# EAGLE design Si1145 (EAGLE 7.4.0)
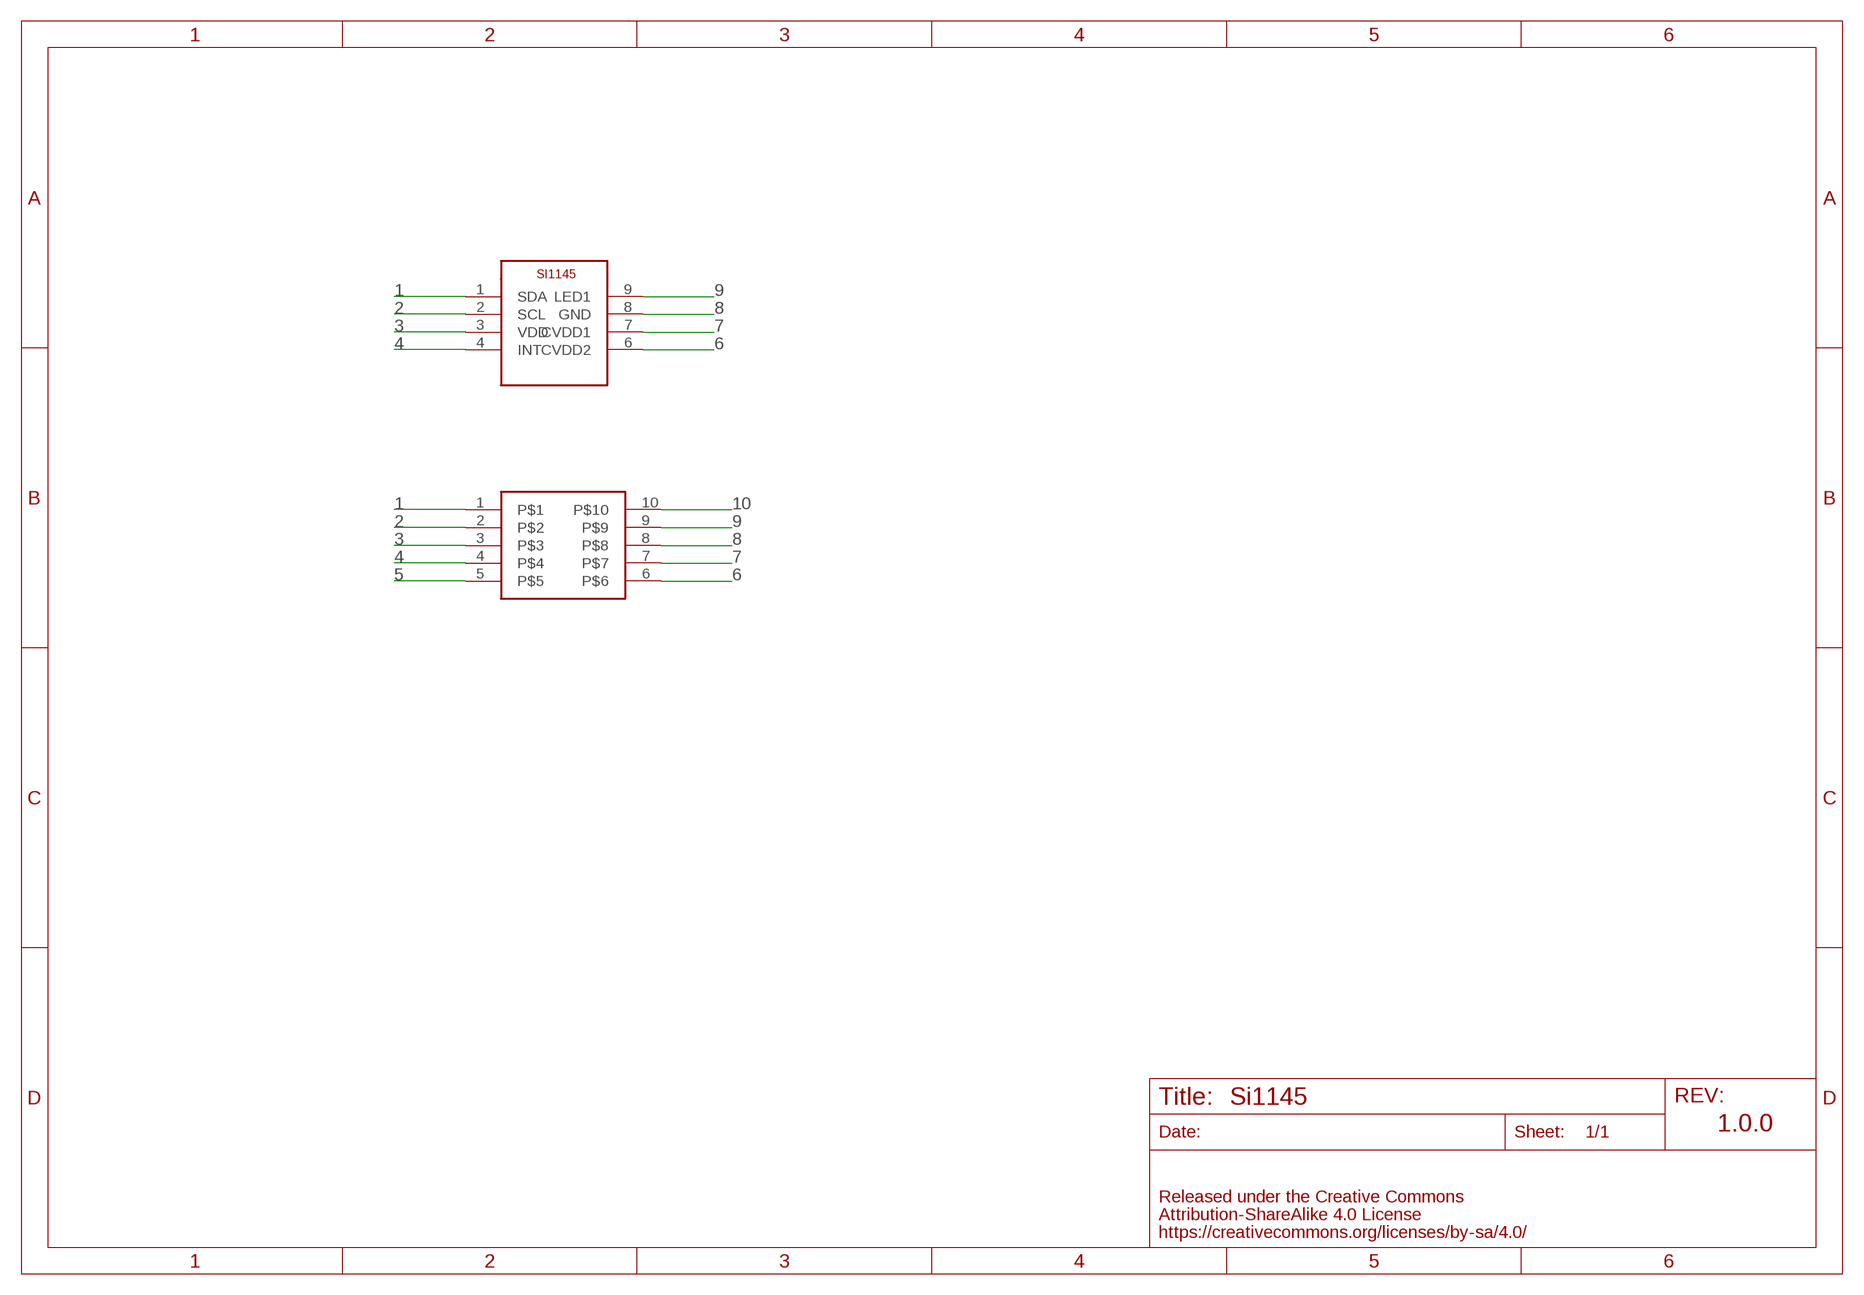
[diagram p0: schematic, sheet 1]

## Parts
SI1145  SL-SI1145  [SILICONLABS-SI1145]
U$2  10PIN  [10PIN]

## Nets
1: SI1145.1(SDA) U$2.1
2: SI1145.2(SCL) U$2.2
3: SI1145.3(VDD) U$2.3
4: SI1145.4(INT) U$2.4
5: U$2.5
6: SI1145.6(CVDD2) U$2.6
7: SI1145.7(CVDD1) U$2.7
8: SI1145.8(GND) U$2.8
9: SI1145.9(LED1) U$2.9
10: U$2.10

## Notes on the sheet
- 1.0.0

## Library data of the parts
SI1145 = FaBo-Mems:SL-SI1145: SILICONLABS SI1145(PROXIMITY/UV/AMBIENT LIGHT SENSOR)
U$2 = FaBo-Breakout:10PIN

## Board
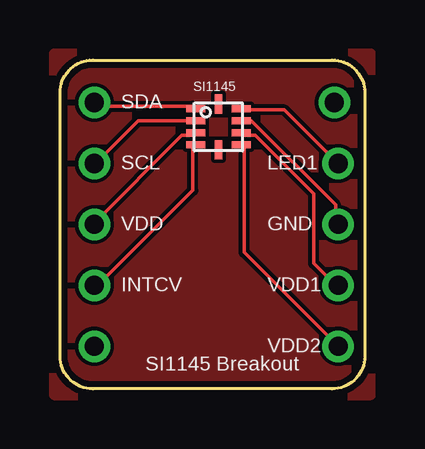
[diagram p1: board, top side]
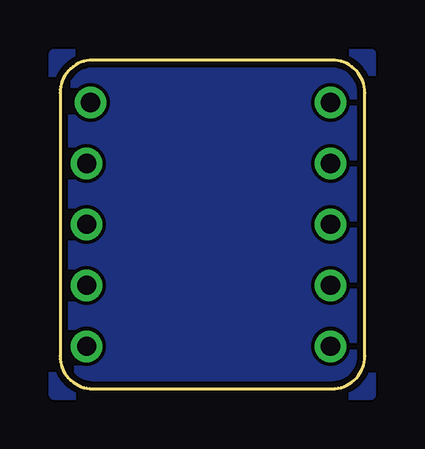
[diagram p2: board, bottom side, seen from below]

Size 12.7 x 13.7 mm. Coordinates in mm from the lower left corner, seen from the top.
Copper layers (1*16): Top 0.035mm / dielectric 1.5mm / Bottom 0.035mm
Design rules "Elecrow_2-layer_eagle_rule": minimum track width 6mil, minimum drill 12mil, track to track 6mil, track to pad 6mil, pad to pad 6mil, via to via 6mil, smd to smd 0mil, copper to edge 10mil, drill to drill 10mil, minimum pad ring 10mil, minimum via ring 6mil, stop-mask expansion 2mil, vias tented up to drill 100mil, thermal gap 10mil

### Footprints (pad centres in the part's own frame; a part is rotated, then mirrored left to right if it is on the bottom)
SILICONLABS-SI1145 = smd 0.8 x 0.3: 1 -0.95,0.752; 2 -0.95,0.252; 3 -0.95,-0.248; 4 -0.95,-0.748; 6 0.95,-0.748; 7 0.95,-0.248; 8 0.95,0.252; 9 0.95,0.752 | smd 0.3 x 0.8: 5 0,-0.95; 10 0,0.95
10PIN = drill 0.8: 1 -4.92,1.27; 2 -4.92,-1.27; 3 -4.92,-3.81; 4 -4.92,-6.35; 5 -4.92,-8.89; 6 5.24,-8.89; 7 5.24,-6.35; 8 5.24,-3.81; 9 5.24,-1.27; 10 5.08,1.27

### Placement (x,y rotation side)
SI1145  6.6,10.91 0 top
U$2  6.35,10.66 0 top

### Tracks (layer width: path | path; a pad name or v marks a point on that pad's centre or on a via)
1
  Top 0.152: SI1145.1 5.54,11.78 1.73,11.78 1.57,11.93 U$2.1
2
  Top 0.152: SI1145.2 5.54,11.17 3.25,11.17 1.57,9.49 U$2.2
3
  Top 0.152: SI1145.3 5.54,10.56 5.08,10.56 1.42,6.9 U$2.3
4
  Top 0.152: SI1145.4 5.54,10.1 5.54,8.27 1.57,4.31 U$2.4
6
  Top 0.152: SI1145.6 7.67,10.1 7.67,5.68 11.48,1.87 U$2.6
7
  Top 0.152: SI1145.7 7.67,10.56 8.13,10.56 10.57,8.12 10.57,5.22 11.48,4.31 U$2.7
8
  Top 0.152: SI1145.8 7.67,11.17 7.98,11.17 11.48,7.66 11.48,6.9 U$2.8
9
  Top 0.152: SI1145.9 7.67,11.62 9.35,11.62 11.48,9.49 U$2.9
GND
  pour Top: -0.25,-0.26 12.95,-0.26 12.95,13.96 -0.25,13.96
  pour Bottom: 0,-0.26 12.95,-0.26 12.95,13.96 -0.25,13.96 -0.25,-0.26

### Text on the board
tPlace: SDA | SCL | LED1 | VDD | GND | INTCV | VDD1 | VDD2 | SI1145 Breakout